# EAGLE design vca_chorus_pots (EAGLE 7.6.0)
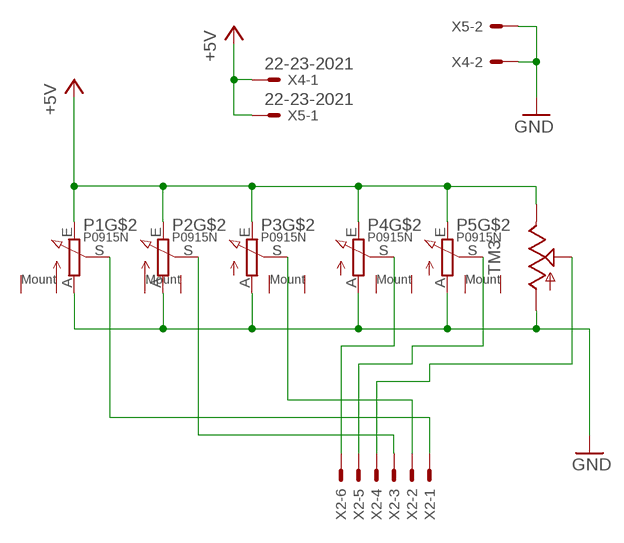
[diagram p0: schematic, sheet 1]

## Parts
P1  P0915N  [P0915N]
P2  P0915N  [P0915N]
P3  P0915N  [P0915N]
P4  P0915N  [P0915N]
P5  P0915N  [P0915N]
TM3  TRIMSLIDE60  [SLIDEPOT-60]
X2  22-23-2061  [22-23-2061]
X4  22-23-2021  [22-23-2021]
X5  22-23-2021  [22-23-2021]

## Nets
+5V: P1.E P2.E P3.E P4.E P5.E TM3.B X4.1 X5.1
GND: P1.A P2.A P3.A P4.A P5.A TM3.A X4.2 X5.2
N$1: P1.S X2.1
N$2: P2.S X2.3
N$3: P3.S X2.2
N$4: P4.S X2.6
N$5: P5.S X2.5
N$6: TM3.WIPER X2.4
Unconnected: P1.GND@1(GND) P1.GND@2(GND) P2.GND@1(GND) P2.GND@2(GND) P3.GND@1(GND) P3.GND@2(GND) P4.GND@1(GND) P4.GND@2(GND) P5.GND@1(GND) P5.GND@2(GND)

## Library data of the parts
P1-P5 = pot-tt_electronics:P0915N
TM3 = stefan-lochbrunner_EAGLE_master_custom%20libraries_potentiometers_Bourns%20PTA%20series_Bourns%20PTA%20series:TRIM: Sliding potentiometers Based on Adafruits (https://github.com/adafruit/Adafruit-Eagle-Library) 'TRIM' device. For Bourns PTA series and TT Electronics PSxx series potentiometers.
X2 = con-molex:22-23-2061: .100" (2.54mm) Center Header - 6 Pin; MF: MOLEX; MPN: 22-23-2061; OC_FARNELL: 1462922; OC_NEWARK: 27C1933
X4 X5 = con-molex:22-23-2021: .100" (2.54mm) Center Header - 2 Pin; MF: MOLEX; MPN: 22-23-2021; OC_FARNELL: 1462926; OC_NEWARK: 25C3832

## Board
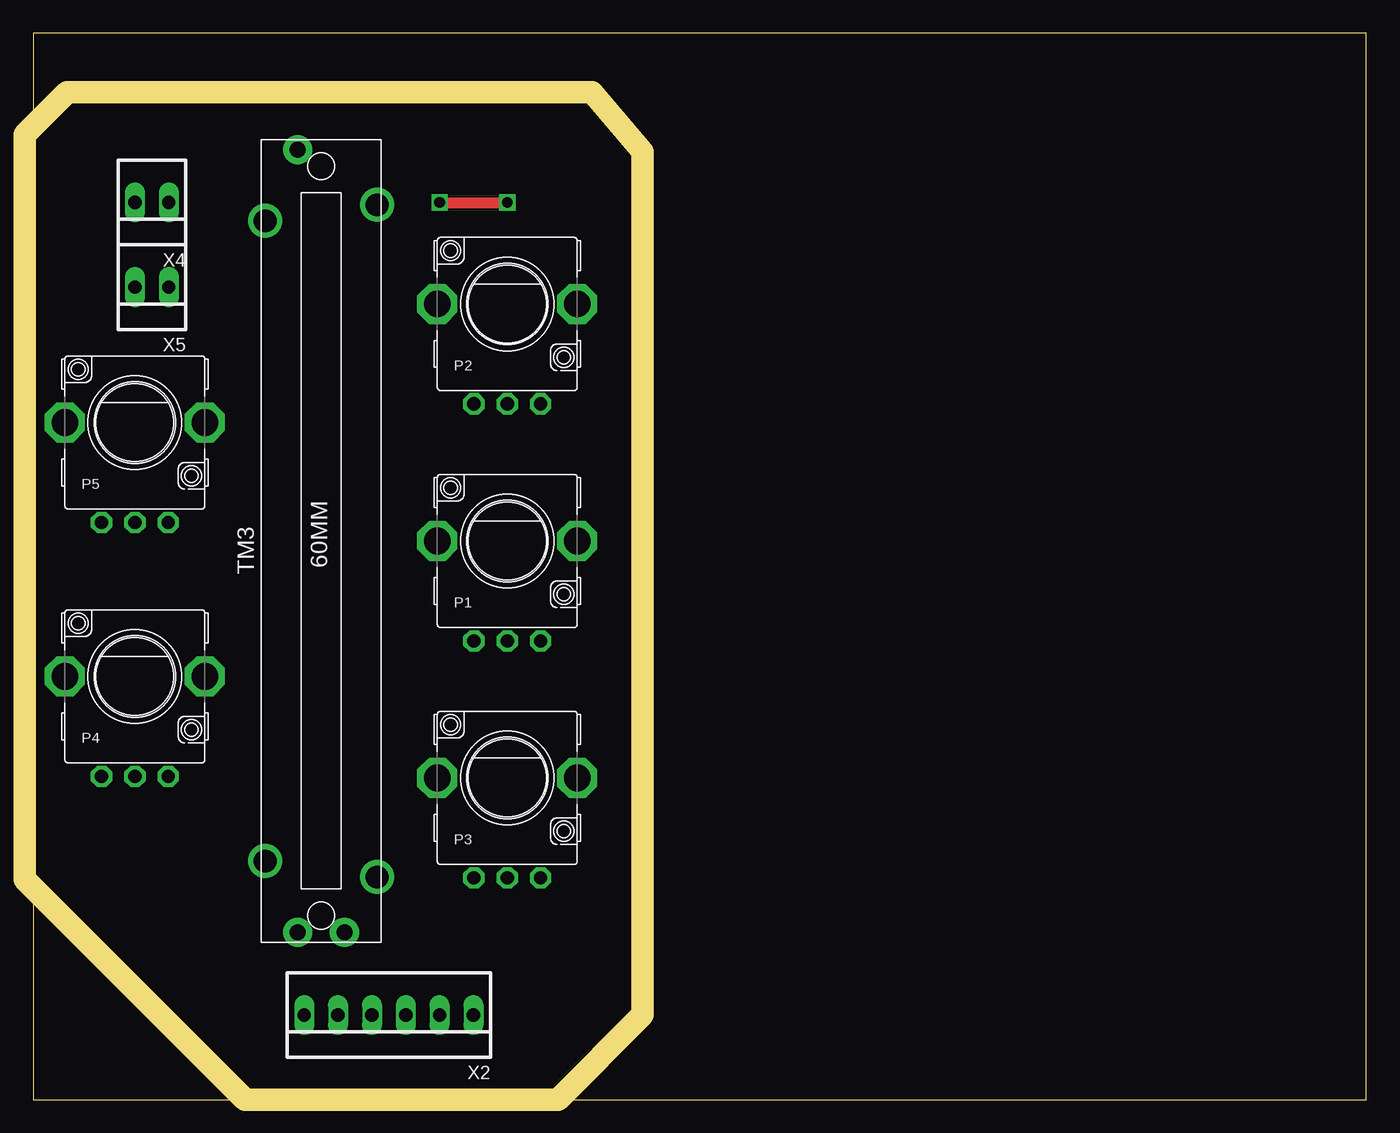
[diagram p1: board, top side]
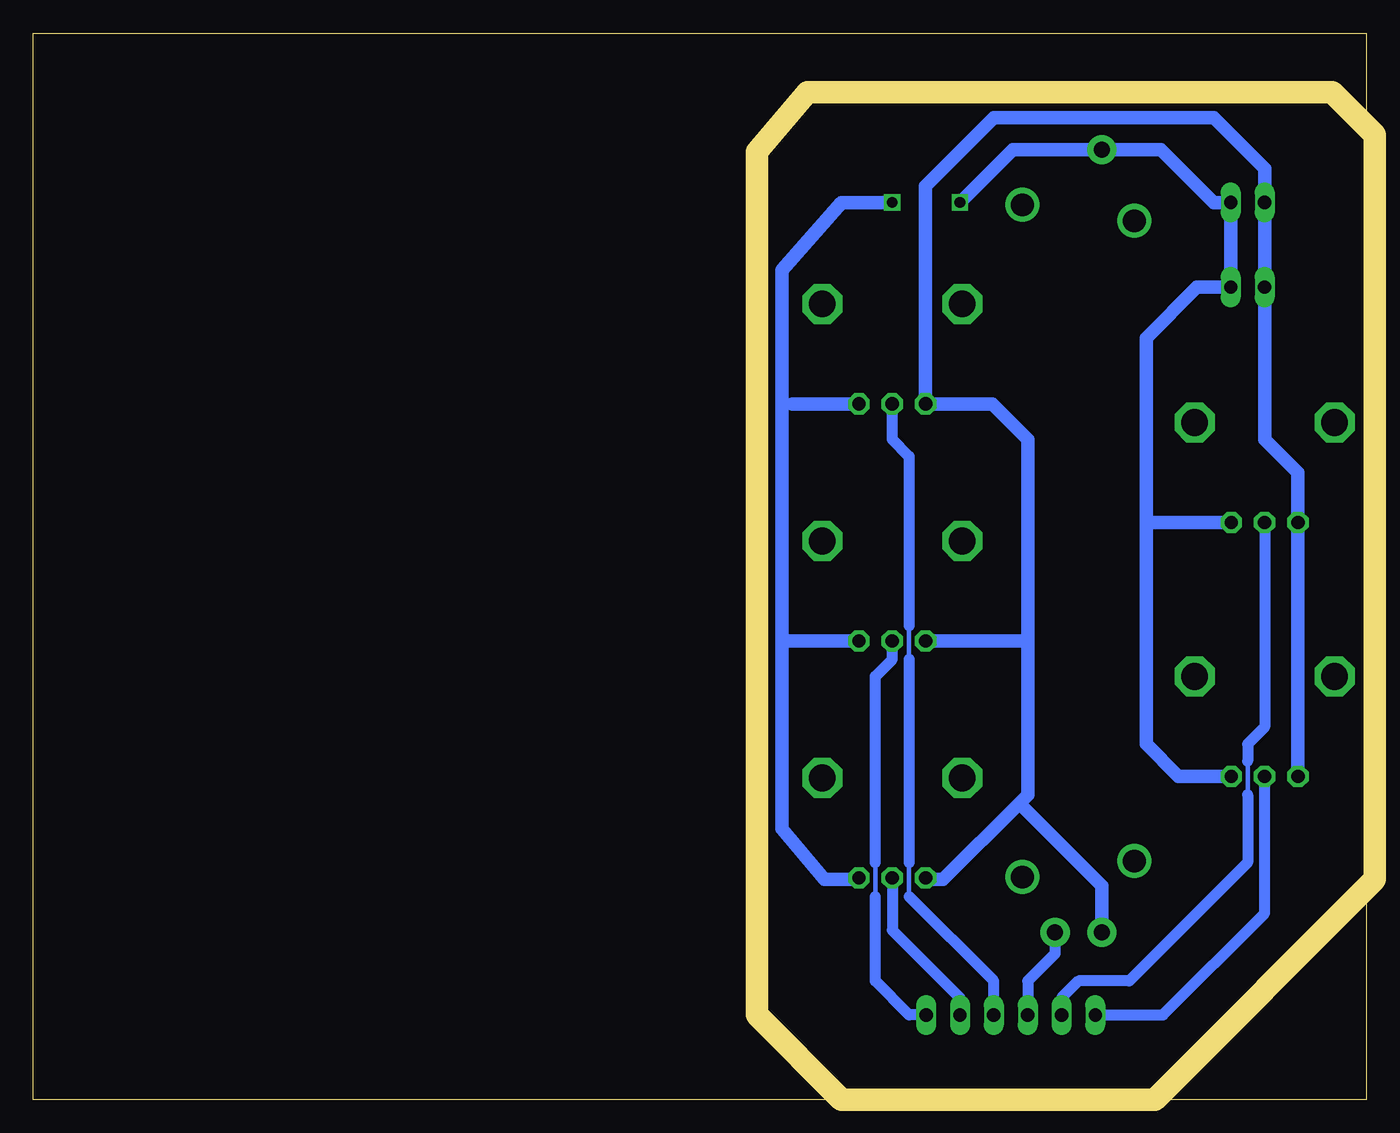
[diagram p2: board, bottom side, seen from below]

Size 100 x 80 mm. Coordinates in mm from the lower left corner, seen from the top.
Outline: 0,0 100,0 100,80 0,80 0,0
Copper layers (1*16): Top 0.035mm / dielectric 1.5mm / Bottom 0.035mm
Design rules "default *": minimum track width 16mil, minimum drill 31mil, track to track 12mil, track to pad 12mil, pad to pad 12mil, via to via 12mil, smd to smd 8mil, copper to edge 0mil, drill to drill 16mil, minimum pad ring 10mil, minimum via ring 8mil, stop-mask expansion 4mil, vias tented up to drill 0mil, thermal gap 10mil
Milling: 8 lines

### Footprints (pad centres in the part's own frame; a part is rotated, then mirrored left to right if it is on the bottom)
P0915N = drill 1 pad 1.6 octagon: A -2.5,-7.5; E 2.5,-7.5; S 0,-7.5 | drill 2 pad 3 octagon: GND@1 -5.25,0; GND@2 5.25,0
SLIDEPOT-60 = drill 1.2 pad 2.184: A -29.37,1.75; B 29.37,1.75; WIPER -29.37,-1.75 | drill 1.7 pad 2.54: P$1 -24.02,4.2; P$2 24.02,4.2; P$3 -25.22,-4.2; P$4 25.22,-4.2
22-23-2061 = drill 1 long: 1 -6.35,0; 2 -3.81,0; 3 -1.27,0; 4 1.27,0; 5 3.81,0; 6 6.35,0
22-23-2021 = drill 1 long: 1 -1.27,0; 2 1.27,0

### Placement (x,y rotation side)
P1  35.56,41.91 0 top
P2  35.56,59.69 0 top
P3  35.56,24.13 0 top
P4  7.62,31.75 0 top
P5  7.62,50.8 0 top
TM3  21.59,41.91 90 top
X2  26.67,6.35 180 top
X4  8.89,67.31 180 top
X5  8.89,60.96 180 top

### Tracks (layer width: path | path; a pad name or v marks a point on that pad's centre or on a via)
+5V  (via drill 0.8)
  Top 0.813: v30.48,67.31 v35.56,67.31
  Bottom 0.813: 43.7,34.41 43.81,34.29 | 38.18,16.51 P3.E | 43.06,52.19 43.81,52.07 | 16.39,43.3 16.51,43.18
  Bottom 1.016: P1.E 43.7,34.41 | 38.18,16.51 40.64,16.51 43.81,20.32 43.81,34.29 43.81,52.07 43.81,62.23 39.37,67.31 v35.56,67.31 | v30.48,67.31 26.51,71.28 TM3.B 15.4,71.28 11.43,67.31 X4.1 X5.1 12.7,60.96 16.51,57.15 16.51,43.18 16.51,26.67 14.09,24.25 P4.E | P2.E 43.06,52.19 | P5.E 16.39,43.3
GND
  Bottom 0.813: P4.A P5.A | 32.94,16.51 P3.A | 25.52,34.41 25.4,34.29
  Bottom 1.016: 26.04,22.23 25.4,22.86 25.4,34.29 25.4,49.53 28.06,52.19 P2.A 33.06,68.54 27.94,73.66 11.43,73.66 7.62,69.85 X4.2 X5.2 7.62,49.53 5.12,47.03 P4.A | 26.04,22.23 31.75,16.51 32.94,16.51 | P1.A 25.52,34.41 | TM3.A 19.84,16.03 26.04,22.23
N$1
  Bottom 0.356: 36.83,15.24 36.83,17.78
  Bottom 0.813: X2.1 34.29,6.35 36.83,8.89 36.83,15.24 | P1.S 35.56,33.02 36.83,31.75 36.83,17.78
N$2
  Bottom 0.356: 34.29,35.56 34.29,33.02 | 34.29,17.78 34.29,15.24
  Bottom 0.813: X2.3 27.94,8.89 34.29,15.24 | P2.S 35.56,49.53 34.29,48.26 34.29,35.56 | 34.29,33.02 34.29,17.78
N$3
  Bottom 0.813: P3.S 35.56,12.7 30.48,7.62 X2.2
N$4
  Bottom 0.813: X2.6 15.24,6.35 7.62,13.97 P4.S
N$5
  Bottom 0.356: 8.89,25.4 8.89,22.86
  Bottom 0.813: P5.S 7.62,27.94 8.89,26.67 8.89,25.4 | X2.5 22.86,7.62 21.59,8.89 17.78,8.89 8.89,17.78 8.89,22.86
N$6
  Bottom 0.813: TM3.WIPER 23.34,10.95 25.4,8.89 X2.4